# Altium schematic sheet Sheet2.SchDoc
size A3 portrait
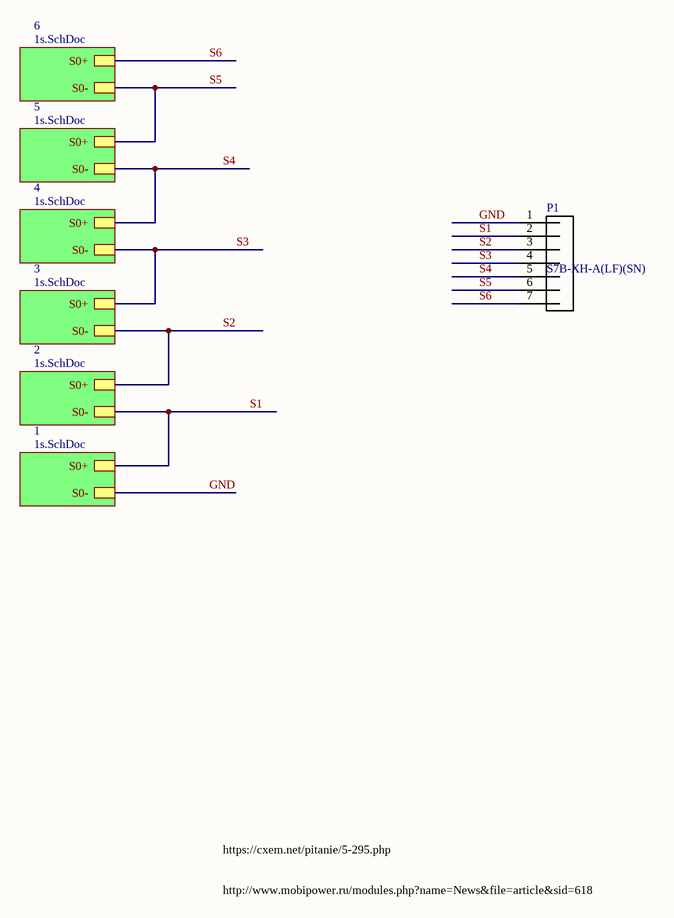
[diagram p0: Sheet2.SchDoc]

## Parts
P1  S7B-XH-A(LF)(SN)  [*JST_S7B-XH-A(LF)(SN)]

## Sub-sheets
1 = 1s.SchDoc: S0-, S0+
2 = 1s.SchDoc: S0-, S0+
3 = 1s.SchDoc: S0-, S0+
4 = 1s.SchDoc: S0-, S0+
5 = 1s.SchDoc: S0-, S0+
6 = 1s.SchDoc: S0-, S0+

## Nets
GND: P1.1 ; sheet 1/S0-
S1: P1.2 ; sheet 1/S0+, sheet 2/S0-
S2: P1.3 ; sheet 2/S0+, sheet 3/S0-
S3: P1.4 ; sheet 3/S0+, sheet 4/S0-
S4: P1.5 ; sheet 4/S0+, sheet 5/S0-
S5: P1.6 ; sheet 5/S0+, sheet 6/S0-
S6: P1.7 ; sheet 6/S0+

## Notes on the sheet
- https://cxem.net/pitanie/5-295.php
- http://www.mobipower.ru/modules.php?name=News&file=article&sid=618
- Title
- Size:
- Date:
- A3
- Number:
- Time:
- Revision:
- Sheet
- of
- File:

## Library data of the parts
P1 = S7B-XH-A(LF)(SN): XH Series 7 Position 2.5 mm Through Hole Right Angle Press Fit Shrouded Header; MP: S4B-XH-A_LF__SN_; MF: JST Sales; Package: None; SnapEDA_Link: https://www.snapeda.com/parts/S4B-XH-A%28LF%29%28SN%29/JST%20Sales%20America%20Inc./view-part/?ref=snap; Availability: Unavailable; Price: None; Value: *